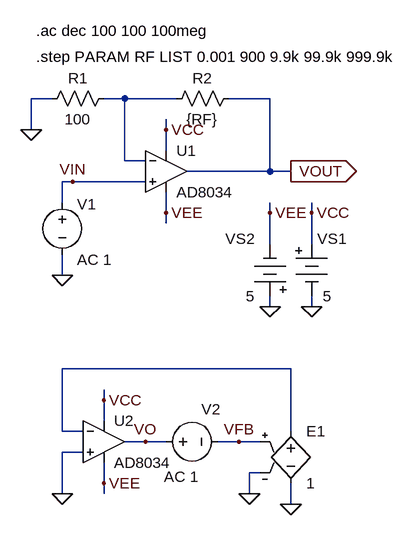
[diagram p0: schematic fig-02-02-06.asc]
fig-02-02-06.asc, the LTspice schematic file:
Version 4
SHEET 1 1180 968
WIRE 32 64 0 64
WIRE 144 64 112 64
WIRE 224 64 144 64
WIRE 368 64 304 64
WIRE 0 112 0 64
WIRE 208 112 208 96
WIRE 208 144 208 112
WIRE 144 160 144 64
WIRE 176 160 144 160
WIRE 368 176 368 64
WIRE 368 176 240 176
WIRE 400 176 368 176
WIRE 64 192 48 192
WIRE 176 192 64 192
WIRE 48 224 48 192
WIRE 208 240 208 208
WIRE 368 240 368 224
WIRE 432 240 432 224
WIRE 208 256 208 240
WIRE 368 288 368 240
WIRE 432 288 432 240
WIRE 48 336 48 304
WIRE 368 384 368 368
WIRE 432 384 432 368
WIRE 400 480 48 480
WIRE 112 528 112 512
WIRE 112 560 112 528
WIRE 48 576 48 480
WIRE 80 576 48 576
WIRE 400 576 400 480
WIRE 176 592 144 592
WIRE 208 592 176 592
WIRE 320 592 288 592
WIRE 352 592 320 592
WIRE 80 608 48 608
WIRE 352 640 336 640
WIRE 112 656 112 624
WIRE 48 672 48 608
WIRE 112 672 112 656
WIRE 336 672 336 640
WIRE 400 688 400 656
FLAG 0 112 0
FLAG 48 336 0
FLAG 400 176 VOUT
IOPIN 400 176 Out
FLAG 64 192 VIN
FLAG 368 384 0
FLAG 432 384 0
FLAG 368 240 VEE
FLAG 432 240 VCC
FLAG 208 112 VCC
FLAG 208 240 VEE
FLAG 48 672 0
FLAG 112 528 VCC
FLAG 112 656 VEE
FLAG 336 672 0
FLAG 400 688 0
FLAG 176 592 VO
FLAG 320 592 VFB
SYMBOL res 128 48 R90
WINDOW 0 0 56 VBottom 2
WINDOW 3 32 56 VTop 2
SYMATTR InstName R1
SYMATTR Value 100
SYMBOL res 320 48 R90
WINDOW 0 0 56 VBottom 2
WINDOW 3 32 56 VTop 2
SYMATTR InstName R2
SYMATTR Value {RF}
SYMBOL voltage 48 208 R0
WINDOW 0 23 19 Left 2
WINDOW 3 -48 163 Left 2
WINDOW 123 23 104 Left 2
WINDOW 39 0 0 Left 0
SYMATTR InstName V1
SYMATTR Value ""
SYMATTR Value2 AC 1
SYMBOL Misc\\battery 432 272 R0
WINDOW 0 9 8 Left 2
WINDOW 3 17 96 Left 2
WINDOW 123 0 0 Left 0
WINDOW 39 0 0 Left 0
SYMATTR InstName VS1
SYMATTR Value 5
SYMBOL Misc\\battery 368 384 R180
WINDOW 0 24 104 Left 2
WINDOW 3 24 16 Left 2
WINDOW 123 0 0 Left 0
WINDOW 39 0 0 Left 0
SYMATTR InstName VS2
SYMATTR Value 5
SYMBOL Opamps\\AD8034 208 112 R0
SYMATTR InstName U1
SYMBOL voltage 192 592 M90
WINDOW 0 -50 100 VLeft 2
WINDOW 3 -48 163 Left 2
WINDOW 123 54 66 VLeft 2
WINDOW 39 0 0 Left 0
SYMATTR InstName V2
SYMATTR Value ""
SYMATTR Value2 AC 1
SYMBOL Opamps\\AD8034 112 528 R0
SYMATTR InstName U2
SYMBOL e 400 560 R0
SYMATTR InstName E1
SYMATTR Value 1
TEXT 8 -40 Left 2 !.ac dec 100 100 100meg
TEXT 8 0 Left 2 !.step PARAM RF LIST 0.001 900 9.9k 99.9k 999.9k

The netlist it stands for:
* fig-02-02-06.asc
R1 N001 0 100
R2 VOUT N001 {RF}
V1 VIN 0 AC 1
VS1 VCC 0 5
VS2 0 VEE 5
XU1 VIN N001 VCC VEE VOUT AD8034  ; pins In+ In- V+ V- OUT
V2 VO VFB AC 1
XU2 0 N002 VCC VEE VO AD8034  ; pins In+ In- V+ V- OUT
E1 N002 0 VFB 0 1
.ac dec 100 100 100meg
.step PARAM RF LIST 0.001 900 9.9k 99.9k 999.9k
.backanno
.end